# EasyEDA Pro project ProPrj_nrf52833_LighthouseTag_2025-07-26.epro, schematic Schematic4_1
Board Name: Positioning tag; Create Date: 2025-06-04; Page Name: P1; Project Name: Magnetic robot_hkust_bi; Schematic Name: Schematic4; Update Date: 2025-07-18; Company: 嘉立创EDA; Page Size: A4; Version: V1.0
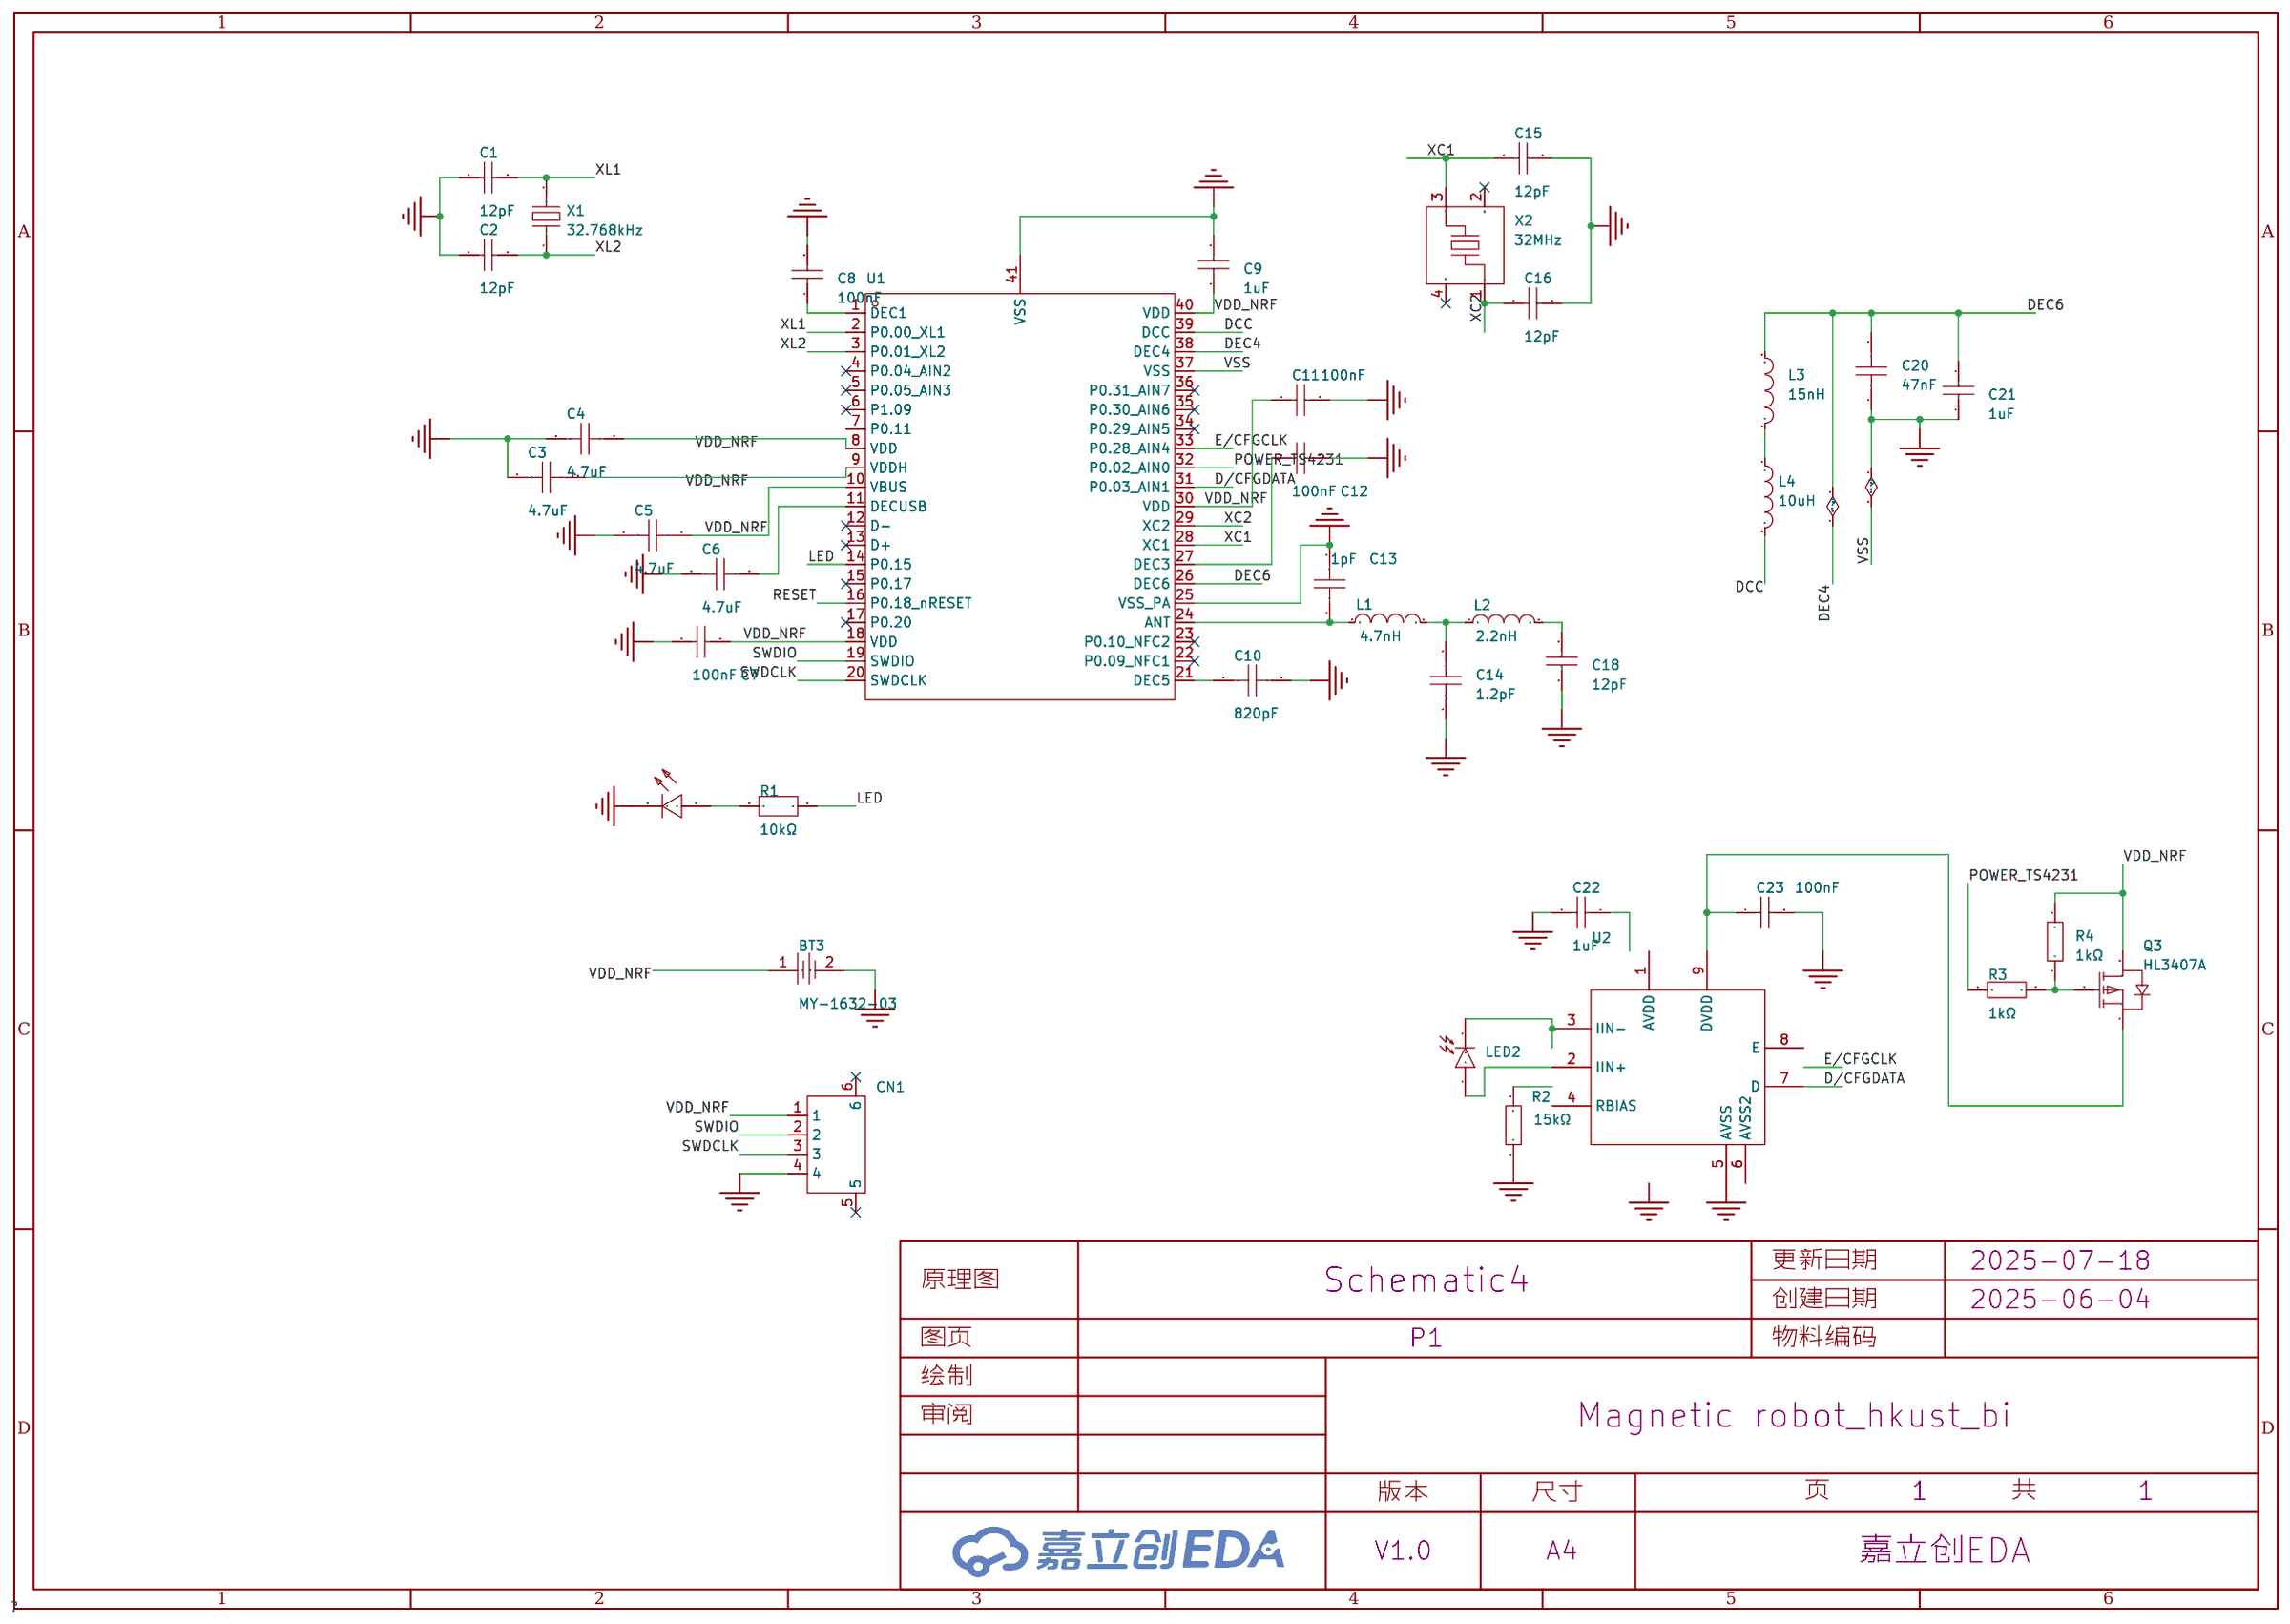
[diagram p1: schematic sheet]

## Parts
BT3  MY-1632-03  [BAT-SMD_MY-1632-03]
C1  12pF  [C0402]
C2  12pF  [C0402]
C3  4.7uF  [C0201]
C4  4.7uF  [C0201]
C5  4.7uF  [C0201]
C6  4.7uF  [C0201]
C7  100nF  [C0201]
C8  100nF  [C0201]
C9  1uF  [C0201]
C10  820pF  [C0402]
C11  100nF  [C0201]
C12  100nF  [C0201]
C13  1pF  [C0201]
C14  1.2pF  [C0201]
C15  12pF  [C0402]
C16  12pF  [C0402]
C18  12pF  [C0402]
C20  47nF  [C0201]
C21  1uF  [C0201]
C22  1uF  [C0201]
C23  100nF  [C0201]
CN1  1.0-4PWB  [CONN-SMD_4P-P1.00_DEALON_1.0-4PWB]
L1  4.7nH  [IND-SMD_L1.0-W0.6]
L2  2.2nH  [IND-SMD_L1.0-W0.6]
L3  15nH  [IND-SMD_L1.0-W0.5-2]
L4  10uH  [IND-SMD_L2.5-W2.0]
LED1  NCD0603G1  [LED0603-RD_1]
LED2  VBPW34S  [SENSOR-SMD_L4.4-W3.9]
Q3  HL3407A  [SOT-23-3_L2.9-W1.3-P1.90-LS2.4-BL-1]
R1  10kΩ  [R0201]
R2  15kΩ  [R0402]
R3  1kΩ  [R0201]
R4  1kΩ  [R0201]
U1  nRF52833-QDAA-R  [QFN-40_L5.0-W5.0-P0.40-TL-EP3.6]
U2  -  [TS4231]
X1  32.768kHz  [OSC-SMD_L3.2-W1.5]
X2  32MHz  [CRYSTAL-SMD_4P-L2.0-W1.6-BL-2]

## Library data of the parts
BT3 = MY-1632-03: 连接器类型:电池扣;适用电池规格:CR1632;触头材质:磷青铜;触点电镀:镍;工作温度范围:-;; LCSC Part Name: 电池扣 适用电池:CR1632; Supplier Part: C2902337; Manufacturer: MYOUNG(美阳); Supplier Footprint: SMD; JLCPCB Part Class: 扩展库; Datasheet: https://atta.szlcsc.com/upload/public/pdf/source/20210930/472CF4FBD9839664A13EAEB041674A4D.pdf; Supplier: LCSC; Connector Type: 电池扣; Battery Type: CR1632; Contact Material: 磷青铜; Contact Plating: 镍
C1 C2 C15 C16 C18 = GRM1555C1H120JA01D: 容值:12pF;精度:±5%;额定电压:50V;温度系数:C0G;; LCSC Part Name: 12pF ±5% 50V; Supplier Part: C76948; Manufacturer: muRata(村田); Supplier Footprint: 0402; JLCPCB Part Class: Extended Part; Datasheet: https://atta.szlcsc.com/upload/public/pdf/source/20180307/C76948_15204091175261407736.pdf; Supplier: LCSC; Tolerance: ±5%; Voltage Rating: 50V; Temperature Coefficient: C0G
C3-C6 = GRM035R60J475ME15D: 容值:4.7uF;精度:±20%;额定电压:6.3V;温度系数:X5R;; LCSC Part Name: 4.7uF ±20% 6.3V; Supplier Part: C335103; Manufacturer: muRata(村田); Supplier Footprint: 0201; JLCPCB Part Class: 扩展库; Datasheet: https://atta.szlcsc.com/upload/public/pdf/source/20200305/C490387_23319AE8C154DEB24C505E6C82A8106A.pdf; Supplier: LCSC; Tolerance: ±20%; Voltage Rating: 6.3V; Temperature Coefficient: X5R
C7 C8 C11 C12 C23 = GRM033R61E104KE14D: 容值:100nF;精度:±10%;额定电压:25V;温度系数:X5R;; LCSC Part Name: 100nF ±10% 25V; Supplier Part: C76939; Manufacturer: muRata(村田); Supplier Footprint: 0201; JLCPCB Part Class: 扩展库; Datasheet: https://atta.szlcsc.com/upload/public/pdf/source/20180307/C76939_15204091018551407727.pdf; Supplier: LCSC; Tolerance: ±10%; Voltage Rating: 25V; Temperature Coefficient: X5R
C9 C21 C22 = GRM033R61A105ME44D: 容值:1uF;精度:±20%;额定电压:10V;材质(温度系数):X5R;; LCSC Part Name: 1uF ±20% 10V; Supplier Part: C76935; Manufacturer: muRata(村田); Supplier Footprint: 0201; JLCPCB Part Class: 扩展库; Datasheet: https://atta.szlcsc.com/upload/public/pdf/source/20190904/C426118_85E81C7C1F21FC87C5FB6D536E0847B4.pdf; Supplier: LCSC; Tolerance: ±20%; Voltage Rated: 10V; Temperature Coefficient: X5R
C10 = CC0402KRX7R9BB821: 容值:820pF;精度:±10%;额定电压:50V;材质(温度系数):X7R;; LCSC Part Name: 820pF ±10% 50V; Supplier Part: C107031; Manufacturer: YAGEO(国巨); Supplier Footprint: 0402; JLCPCB Part Class: Extended Part; Datasheet: https://atta.szlcsc.com/upload/public/pdf/source/20200803/C107031_D53C25CCCFEE93078DE0825CA32986C0.pdf; Supplier: LCSC; Tolerance: ±10%; Voltage Rated: 50V; Temperature Coefficient: X7R
C13 = GRM0335C1H1R0BA01D: 容值:1pF;精度:-;额定电压:50V;温度系数:C0G;; LCSC Part Name: ±0.1pF 1pF 50V; Supplier Part: C85893; Manufacturer: muRata(村田); Supplier Footprint: 0201; JLCPCB Part Class: 扩展库; Datasheet: https://atta.szlcsc.com/upload/public/pdf/source/20200305/C490387_23319AE8C154DEB24C505E6C82A8106A.pdf; Supplier: LCSC; Voltage Rating: 50V; Temperature Coefficient: C0G
C14 = GRM0335C1H1R2BA01D: 容值:1.2pF;额定电压:50V;材质(温度系数):C0G;; LCSC Part Name: 1.2pF 50V; Supplier Part: C85895; Manufacturer: muRata(村田); Supplier Footprint: 0201; JLCPCB Part Class: 扩展库; Datasheet: https://atta.szlcsc.com/upload/public/pdf/source/20200305/C490387_23319AE8C154DEB24C505E6C82A8106A.pdf; Supplier: LCSC; Voltage Rated: 50V; Temperature Coefficient: C0G
C20 = CGA0201X5R473K160ET: 容值:47nF;精度:±10%;额定电压:16V;温度系数:X5R;; LCSC Part Name: 47nF ±10% 16V; Supplier Part: C45359887; Manufacturer: HRE(芯声); Supplier Footprint: 0201; JLCPCB Part Class: 扩展库; Datasheet: https://atta.szlcsc.com/upload/public/pdf/source/20250220/29719F0DB54B0A066ED9CF136703C3DF.pdf; Supplier: LCSC; Tolerance: ±10%; Voltage Rating: 16V; Temperature Coefficient: X5R
CN1 = 1.0-4PWB: 插针结构:1x4P;间距:1mm;安装方式:卧贴;参考系列:SH;总PIN数:4P;排数:1;每排PIN数:4;行距:-;额定电流:1A;触头材质:-;触头镀层:-;工作温度:-25~+85;; LCSC Part Name: 1x4P 间距:1mm 卧贴 系列:SH; Supplier Part: C2905006; Manufacturer: DEALON(德艺隆); Supplier Footprint: SMD,P=1mm,卧贴; JLCPCB Part Class: Extended Part; Datasheet: https://atta.szlcsc.com/upload/public/pdf/source/20211108/FAA45F8836A30651AE08A2D9A2D823F3.pdf; Supplier: LCSC; Pins Structure: 1x4P; Pitch: 1mm; Mounting Type: 卧贴; Reference Series: SH; Number of Pins: 4P; Number of Rows: 1; Number of PINs Per Row: 4; Current Rating: 1A; Operating Temperature: -25~+85; Voltage Rating: 50V; Supplementary Features: 辅助焊脚; Color: 米色; Z-Height of the Board: 2.9mm; X-Length of Bottom Edge on Board (Spacing Line): 6mm; Y-Width of Bottom Edge on Board: 5.03mm
L1 = LQW15AN4N7B00D: 电感值:4.7nH;额定电流:750mA;饱和电流(Isat):-;; Supplier Part: C98064; Manufacturer: muRata(村田); Supplier Footprint: 0402; JLCPCB Part Class: Extended Part; Datasheet: https://atta.szlcsc.com/upload/public/pdf/source/20191016/C437364_463D6516B3BAE72B1DA0754F3D9B8308.pdf; Supplier: LCSC; Rated Current: 750mA; DC Resistance (DCR): 70mΩ
L2 = LQW15AN2N2B80D: 电感值:2.2nH;额定电流:2.53A;饱和电流(Isat):-;; Supplier Part: C2041833; Manufacturer: muRata(村田); Supplier Footprint: 0402; JLCPCB Part Class: Extended Part; Datasheet: https://atta.szlcsc.com/upload/public/pdf/source/20210504/828CF85BF1F050871A8563B8C7472C90.pdf; Supplier: LCSC; Rated Current: 2.53A; DC Resistance (DCR): 22mΩ
L3 = LQW15AN15NG00D: 电感值:15nH;精度:±2%;额定电流:460mA;饱和电流(Isat):-;; LCSC Part Name: 15nH ±2%; Supplier Part: C98055; Manufacturer: muRata(村田); Supplier Footprint: 0402; JLCPCB Part Class: Extended Part; Datasheet: https://atta.szlcsc.com/upload/public/pdf/source/20191016/C437364_463D6516B3BAE72B1DA0754F3D9B8308.pdf; Supplier: LCSC; Tolerance: ±2%; Rated Current: 460mA; DC Resistance (DCR): 160mΩ
L4 = FTC252012S100MBCA: 电感值:10uH;精度:±20%;额定电流:1.2A;饱和电流(Isat):1.6A;类型:一体成型电感;; LCSC Part Name: 10uH ±20% 1.6A; Supplier Part: C5832376; Manufacturer: cjiang(长江微电); Supplier Footprint: SMD,2x2.5mm; JLCPCB Part Class: Extended Part; Datasheet: https://atta.szlcsc.com/upload/public/pdf/source/20230602/8FFEDA9C0247A92A0D4B67554BFE4091.pdf; Supplier: LCSC; Tolerance: ±20%; Rated Current: 1.2A; Saturation Current (Isat): 1.6A; DC Resistance (DCR): 330mΩ; Type: 一体成型电感
LED1 = NCD0603G1: 发光颜色:翠绿色;正向压降(Vf):2.6V~3.6V;功率:72mW;正向电流:20mA;波长:515nm~530nm;透镜颜色:-;发光强度:330mcd~900mcd;发光角度:130°;工作温度:-30~+85;; Supplier Part: C84267; Manufacturer: 国星光电; Supplier Footprint: 0603; JLCPCB Part Class: Extended Part; Datasheet: https://atta.szlcsc.com/upload/public/pdf/source/20200820/C84267_04BA7703640BAC111D09F5EFB971FBF3.pdf; Supplier: LCSC; Illumination Color: 翠绿色; Voltage - Forward(Vf): 2.6V~3.6V; Power(Watts): 72mW; Forward Current: 20mA; Wavelength - Dominant: 515nm~530nm; Luminous Intensity: 330mcd~900mcd; Viewing Angle: 130°; Operating Temperature: -30~+85
LED2 = VBPW34S: 反向电压:60V;接收角:-;峰值波长:940nm;频谱范围:430nm~1100nm;暗电流:2nA;; LCSC Part Name: 940nm 频谱范围430nm~1100nm 反向电压60V; Supplier Part: C145262; Manufacturer: VISHAY(威世); Supplier Footprint: SMD,3.9x4.4mm; JLCPCB Part Class: Extended Part; Datasheet: https://atta.szlcsc.com/upload/public/pdf/source/20171211/C145262_15129614507721174601.pdf; Supplier: LCSC; DC Reverse Voltage: 60V; Peak  Wavelength: 940nm; Spectral Range: 430nm~1100nm; Current Dark: 2nA; Operating Temperature: -40~+100
Q3 = HL3407A: 数量:-;漏源电压(Vdss):30V;连续漏极电流(Id):4.1A;导通电阻(RDS(on)):68mΩ@4.5V;耗散功率(Pd):1.2W;阈值电压(Vgs(th)):2.4V@250uA;; LCSC Part Name: P沟道,电流:-4.1A,耐压:-30V; Supplier Part: C28646269; Manufacturer: 宏嘉诚; Supplier Footprint: SOT-23; JLCPCB Part Class: 扩展库; Datasheet: https://atta.szlcsc.com/upload/public/pdf/source/20250627/C6644FDB2DD0D7F1420F626AF38A96D7.pdf; Supplier: LCSC; Drain to Source Voltage: 30V; Current - Continuous Drain(Id): 4.1A; RDS(on): 68mΩ@4.5V; Pd - Power Dissipation: 1.2W; Gate Threshold Voltage (Vgs(th)@Id): 2.4V@250uA; Gate Charge(Qg): 12nC@10V; Input Capacitance(Ciss): 572pF; Reverse Transfer Capacitance (Crss@Vds): 70pF@15V; Operating Temperature: -55℃~+150℃
R1 = 0201WMF1002TEE: 电阻类型:厚膜电阻;阻值:10kΩ;精度:±1%;功率:50mW;最大工作电压:25V;温度系数:±200ppm/℃;; LCSC Part Name: 10kΩ ±1% 50mW 厚膜电阻; Supplier Part: C473048; Manufacturer: UNI-ROYAL(厚声); Supplier Footprint: 0201; JLCPCB Part Class: 扩展库; Datasheet: https://atta.szlcsc.com/upload/public/pdf/source/20200306/C422600_1E6D84923E4A46A82E41ADD87F860B5C.pdf; Supplier: LCSC; Type: 厚膜电阻; Tolerance: ±1%; Power(Watts): 50mW; Overload Voltage (Max): 25V; Temperature Coefficient: ±200ppm/℃; Operating Temperature Range: -55℃~+155℃
R2 = 0402WGF1502TCE: 电阻类型:厚膜电阻;阻值:15kΩ;精度:±1%;功率:62.5mW;最大工作电压:50V;温度系数:±100ppm/;; LCSC Part Name: 15kΩ ±1% 62.5mW 厚膜电阻; Supplier Part: C25756; Manufacturer: UNI-ROYAL(厚声); Supplier Footprint: 0402; JLCPCB Part Class: Basic Part; Datasheet: https://atta.szlcsc.com/upload/public/pdf/source/20200306/C422600_1E6D84923E4A46A82E41ADD87F860B5C.pdf; Supplier: LCSC; Type: 厚膜电阻; Tolerance: ±1%; Power(Watts): 62.5mW; Overload Voltage (Max): 50V; Temperature Coefficient: ±100ppm/; Operating Temperature Range: -55~+155
R3 R4 = 0201WMF1001TEE: 电阻类型:厚膜电阻;阻值:1kΩ;精度:±1%;功率:50mW;最大工作电压:25V;温度系数:±200ppm/℃;; LCSC Part Name: 1kΩ ±1% 50mW 厚膜电阻; Supplier Part: C270365; Manufacturer: UNI-ROYAL(厚声); Supplier Footprint: 0201; JLCPCB Part Class: 扩展库; Datasheet: https://atta.szlcsc.com/upload/public/pdf/source/20200306/C422600_1E6D84923E4A46A82E41ADD87F860B5C.pdf; Supplier: LCSC; Type: 厚膜电阻; Tolerance: ±1%; Power(Watts): 50mW; Overload Voltage (Max): 25V; Temperature Coefficient: ±200ppm/℃; Operating Temperature Range: -55℃~+155℃
U1 = nRF52833-QDAA-R: Supplier Part: C2895249; Manufacturer: NORDIC; Supplier Footprint: QFN-40-EP(5x5); JLCPCB Part Class: Extended Part; Datasheet: https://atta.szlcsc.com/upload/public/pdf/source/20220526/66538D94E2BF566AD23AAE4CF6584247.pdf; Supplier: LCSC
U2 = TS4231
X1 = X321532768KGD2SI: 晶振类型:贴片晶振;频率:32.768kHz;常温频差:±20ppm;外接负载电容:12.5pF;频率稳定度(全温):-;; LCSC Part Name: 32.768kHz ±20ppm 12.5pF; Supplier Part: C620155; Manufacturer: YXC(扬兴晶振); Supplier Footprint: SMD3215-2P; JLCPCB Part Class: Extended Part; Datasheet: https://atta.szlcsc.com/upload/public/pdf/source/20240329/3A7650FD985DD0DE85694D3785AB4916.pdf; Supplier: LCSC; Crystal Type: 贴片晶振; Normal temperature Frequency Tolerance: ±20ppm; External load capacitor: 12.5pF; Operating Temperature: -40~+85
X2 = X201632MOB4SI: 晶振类型:贴片晶振;频率:32MHz;常温频差:±10ppm;负载电容:12pF;频率稳定度:±20ppm;; LCSC Part Name: 32MHz ±10ppm 12pF; Supplier Part: C2682773; Manufacturer: YXC(扬兴晶振); Supplier Footprint: SMD2016-4P; JLCPCB Part Class: Extended Part; Datasheet: https://atta.szlcsc.com/upload/public/pdf/source/20240329/C26C9A15A73CBCFBF373B30A8E126750.pdf; Supplier: LCSC; Type: 贴片晶振; Normal temperature Frequency Tolerance: ±10ppm; Load Capacitance: 12pF; Frequency Stability: ±20ppm; Operating Temperature: -40~+85

## Nets
GND: BT3.2 C1.1 C2.1 C3.2 C4.2 C5.2 C6.2 C7.1 C8.2 C9.2 C10.2 C11.2 C12.2 C13.2 C14.1 C15.2 C16.2 C18.1 C20.1 C21.1 C22.2 C23.2 CN1.4 LED1.1(K) R2.1 U1.25(VSS_PA) U1.37(VSS) U1.41(VSS) U2.5(AVSS)
VDD_NRF: BT3.1 C3.1 C4.1 C5.1 C7.2 C9.1 C11.1 CN1.1 Q3.3(D) R4.2 U1.8(VDD) U1.9(VDDH) U1.10(VBUS) U1.18(VDD) U1.30(VDD) U1.40(VDD)
D/CFGDATA: U1.31(P0.03_AIN1) U2.7(D)
DCC: L4.2 U1.39(DCC)
DEC4: C20.2 C21.2 L3.2 U1.26(DEC6) U1.38(DEC4)
E/CFGCLK: U1.33(P0.28_AIN4)
LED: R1.1 U1.14(P0.15)
POWER_TS4231: R3.1 U1.32(P0.02_AIN0)
RESET: U1.16(P0.18_nRESET)
SWDCLK: CN1.3 U1.20(SWDCLK)
SWDIO: CN1.2 U1.19(SWDIO)
XC1: C15.1 U1.28(XC1) X2.3
XC2: C16.1 U1.29(XC2) X2.1
XL1: C1.2 U1.2(P0.00_XL1) X1.2
XL2: C2.2 U1.3(P0.01_XL2) X1.1
$1N2289: C10.1 U1.21(DEC5)
$1N2530: C13.1 L1.1 U1.24(ANT)
$1N2985: C14.2 L1.2 L2.1
$1N3242: C18.2 L2.2
$1N3495: C12.1 U1.27(DEC3)
$1N6091: L3.1 L4.1
$1N11226: LED2.1(A) U2.2(IIN+)
$1N22902: LED1.2(A) R1.2
$1N23087: C8.1 U1.1(DEC1)
$1N29852: C6.1 U1.11(DECUSB)
$1N31595: Q3.1(G) R3.2 R4.1
Net-(C23-1): C23.1 Q3.2(S) U2.9(DVDD)
Net-(LED2-2): LED2.2(C) U2.3(IIN-)

Not connected (* = marked no-connect by the designer): C22 1; CN1 5* 6*; R2 2; U1 4(P0.04_AIN2)* 5(P0.05_AIN3)* 6(P1.09)* 7(P0.11) 12(D-)* 13(D+)* 15(P0.17)* 17(P0.20)* 22(P0.09_NFC1)* 23(P0.10_NFC2)* 34(P0.29_AIN5)* 35(P0.30_AIN6)* 36(P0.31_AIN7)*; U2 1(AVDD) 4(RBIAS) 6(AVSS2) 8(E); X2 2(GND)* 4(GND)*
